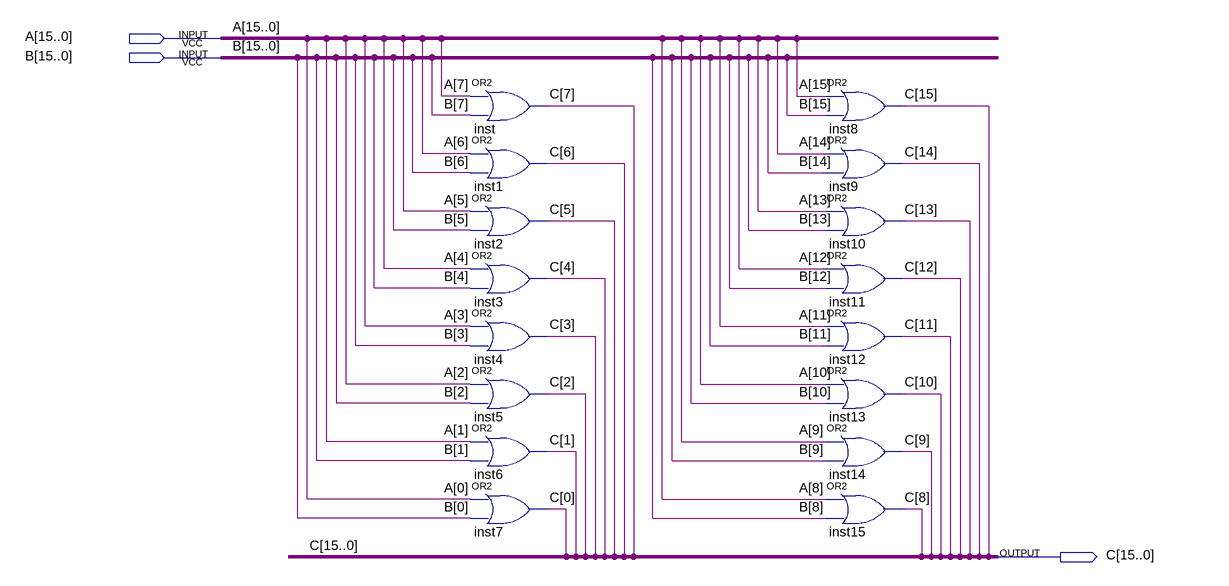
[diagram p0: schematic sheet]
// Quartus schematic OR_unit.bdf as structural Verilog: 16 symbols, 3 pins
module OR_unit (
  input  [15:0] A,
  input  [15:0] B,
  output [15:0] C
);

  or inst (C[7], A[7], B[7]);
  or inst1 (C[6], A[6], B[6]);
  or inst2 (C[5], A[5], B[5]);
  or inst3 (C[4], A[4], B[4]);
  or inst4 (C[3], A[3], B[3]);
  or inst5 (C[2], A[2], B[2]);
  or inst6 (C[1], A[1], B[1]);
  or inst7 (C[0], A[0], B[0]);
  or inst8 (C[15], A[15], B[15]);
  or inst9 (C[14], A[14], B[14]);
  or inst10 (C[13], A[13], B[13]);
  or inst11 (C[12], A[12], B[12]);
  or inst12 (C[11], A[11], B[11]);
  or inst13 (C[10], A[10], B[10]);
  or inst14 (C[9], A[9], B[9]);
  or inst15 (C[8], A[8], B[8]);
endmodule
